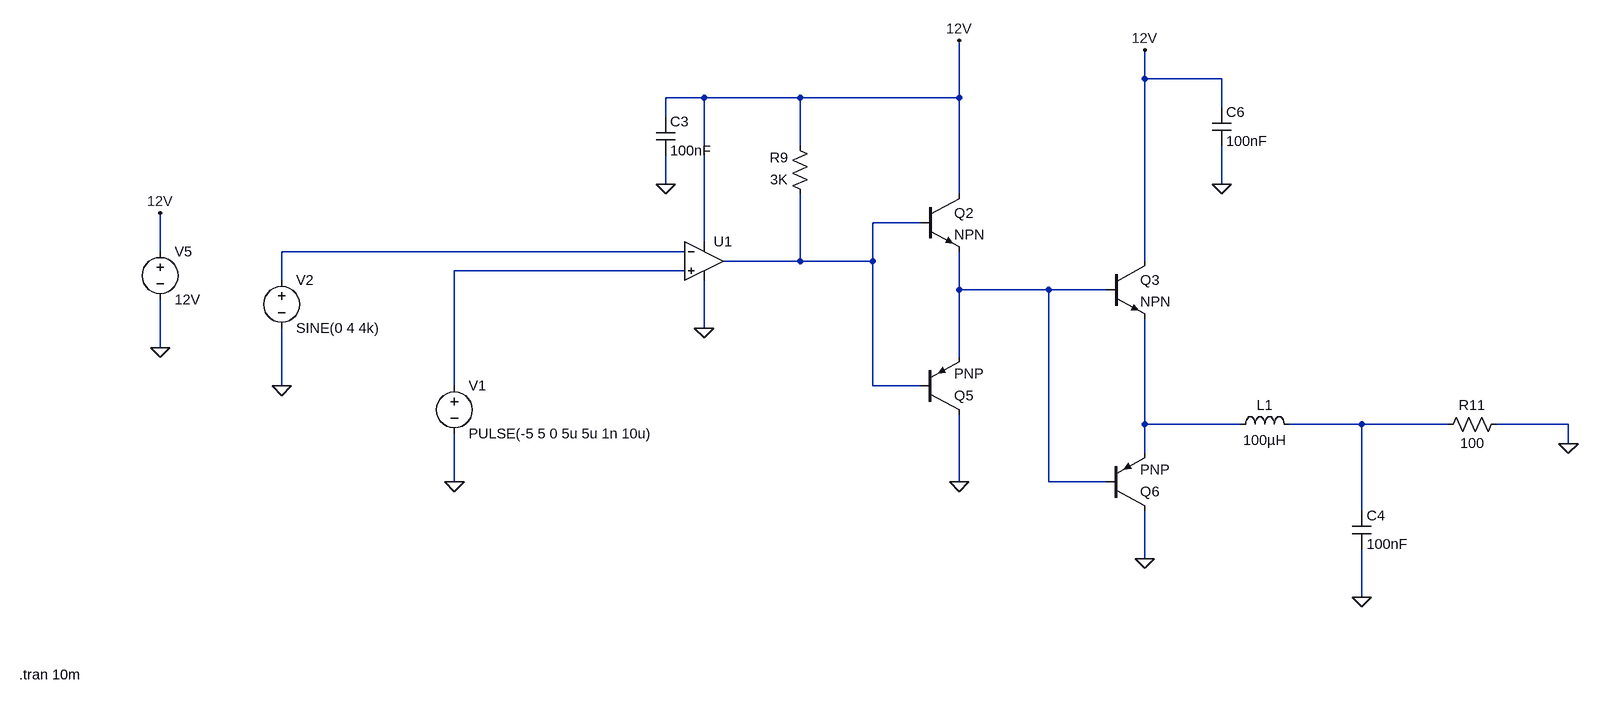
[diagram p0: schematic class D amplifier.asc]
class D amplifier.asc, the LTspice schematic file:
Version 4.1
SHEET 1 3188 728
WIRE 2192 -320 2192 -368
WIRE 2320 -320 2192 -320
WIRE 1424 -288 1360 -288
WIRE 1584 -288 1424 -288
WIRE 1856 -288 1856 -384
WIRE 1856 -288 1584 -288
WIRE 2320 -272 2320 -320
WIRE 1360 -256 1360 -288
WIRE 1584 -208 1584 -288
WIRE 1360 -144 1360 -192
WIRE 2320 -144 2320 -208
WIRE 1856 -128 1856 -288
WIRE 1792 -80 1712 -80
WIRE 1424 -48 1424 -288
WIRE 96 -32 96 -96
WIRE 1392 -32 720 -32
WIRE 1584 -16 1584 -128
WIRE 1584 -16 1456 -16
WIRE 1712 -16 1712 -80
WIRE 1712 -16 1584 -16
WIRE 2192 -16 2192 -320
WIRE 1392 0 1008 0
WIRE 720 16 720 -32
WIRE 1856 32 1856 -32
WIRE 2032 32 1856 32
WIRE 2128 32 2032 32
WIRE 1424 96 1424 16
WIRE 96 128 96 48
WIRE 1856 144 1856 32
WIRE 720 192 720 96
WIRE 1008 192 1008 0
WIRE 1712 192 1712 -16
WIRE 1792 192 1712 192
WIRE 2192 256 2192 80
WIRE 2352 256 2192 256
WIRE 2592 256 2432 256
WIRE 2736 256 2592 256
WIRE 3168 256 2816 256
WIRE 3168 288 3168 256
WIRE 2192 304 2192 256
WIRE 1008 352 1008 272
WIRE 1856 352 1856 240
WIRE 2032 352 2032 32
WIRE 2128 352 2032 352
WIRE 2592 400 2592 256
WIRE 2192 480 2192 400
WIRE 2592 544 2592 464
FLAG 1424 96 0
FLAG 1856 352 0
FLAG 1360 -144 0
FLAG 2192 480 0
FLAG 2592 544 0
FLAG 2320 -144 0
FLAG 720 192 0
FLAG 1008 352 0
FLAG 96 128 0
FLAG 96 -96 12V
FLAG 1856 -384 12V
FLAG 2192 -368 12V
FLAG 3168 288 0
SYMBOL res 1600 -112 R180
WINDOW 0 36 76 Left 2
WINDOW 3 36 40 Left 2
SYMATTR InstName R9
SYMATTR Value 3K
SYMBOL cap 1344 -256 R0
SYMATTR InstName C3
SYMATTR Value 100nF
SYMBOL npn3 1792 -128 R0
SYMATTR InstName Q2
SYMBOL npn3 2128 -16 R0
SYMATTR InstName Q3
SYMBOL pnp2 1792 240 M180
SYMATTR InstName Q5
SYMBOL pnp2 2128 400 M180
SYMATTR InstName Q6
SYMBOL OpAmps\\UniversalOpAmp 1424 -16 R0
SYMATTR InstName U1
SYMBOL ind 2336 272 R270
WINDOW 0 32 56 VTop 2
WINDOW 3 5 56 VBottom 2
SYMATTR InstName L1
SYMATTR Value 100µH
SYMBOL cap 2576 400 R0
SYMATTR InstName C4
SYMATTR Value 100nF
SYMBOL res 2832 240 R90
WINDOW 0 0 56 VBottom 2
WINDOW 3 32 56 VTop 2
SYMATTR InstName R11
SYMATTR Value 100
SYMBOL cap 2304 -272 R0
SYMATTR InstName C6
SYMATTR Value 100nF
SYMBOL voltage 1008 176 R0
WINDOW 123 0 0 Left 0
WINDOW 39 0 0 Left 0
SYMATTR InstName V1
SYMATTR Value PULSE(-5 5 0 5u 5u 1n 10u)
SYMBOL voltage 720 0 R0
WINDOW 123 0 0 Left 0
WINDOW 39 0 0 Left 0
SYMATTR InstName V2
SYMATTR Value SINE(0 4 4k)
SYMBOL voltage 96 -48 R0
WINDOW 123 0 0 Left 0
WINDOW 39 0 0 Left 0
SYMATTR InstName V5
SYMATTR Value 12V
TEXT -384 712 Left 2 !.tran 10m

The netlist it stands for:
* class D amplifier.asc
R9 N001 12V 3K
C3 12V 0 100nF
Q2 12V N001 N004 0 NPN
Q3 12V N004 N005 0 NPN
Q5 0 N001 N004 0 PNP
Q6 0 N004 N005 0 PNP
X§U1 N003 N002 12V 0 N001 level1 Avol=1Meg GBW=10Meg Vos=0 En=0 Enk=0 In=0 Ink=0 Rin=500Meg  ; pins In+ In- V+ V- OUT
L1 N005 N006 100µH
C4 N006 0 100nF
R11 0 N006 100
C6 12V 0 100nF
V1 N003 0 PULSE(-5 5 0 5u 5u 1n 10u)
V2 N002 0 SINE(0 4 4k)
V5 12V 0 12V
.model NPN NPN
.model PNP PNP
.lib standard.bjt
.tran 10m
.lib UniversalOpAmp1.lib
.backanno
.end